# Altium schematic sheet mcu.SchDoc
size A3
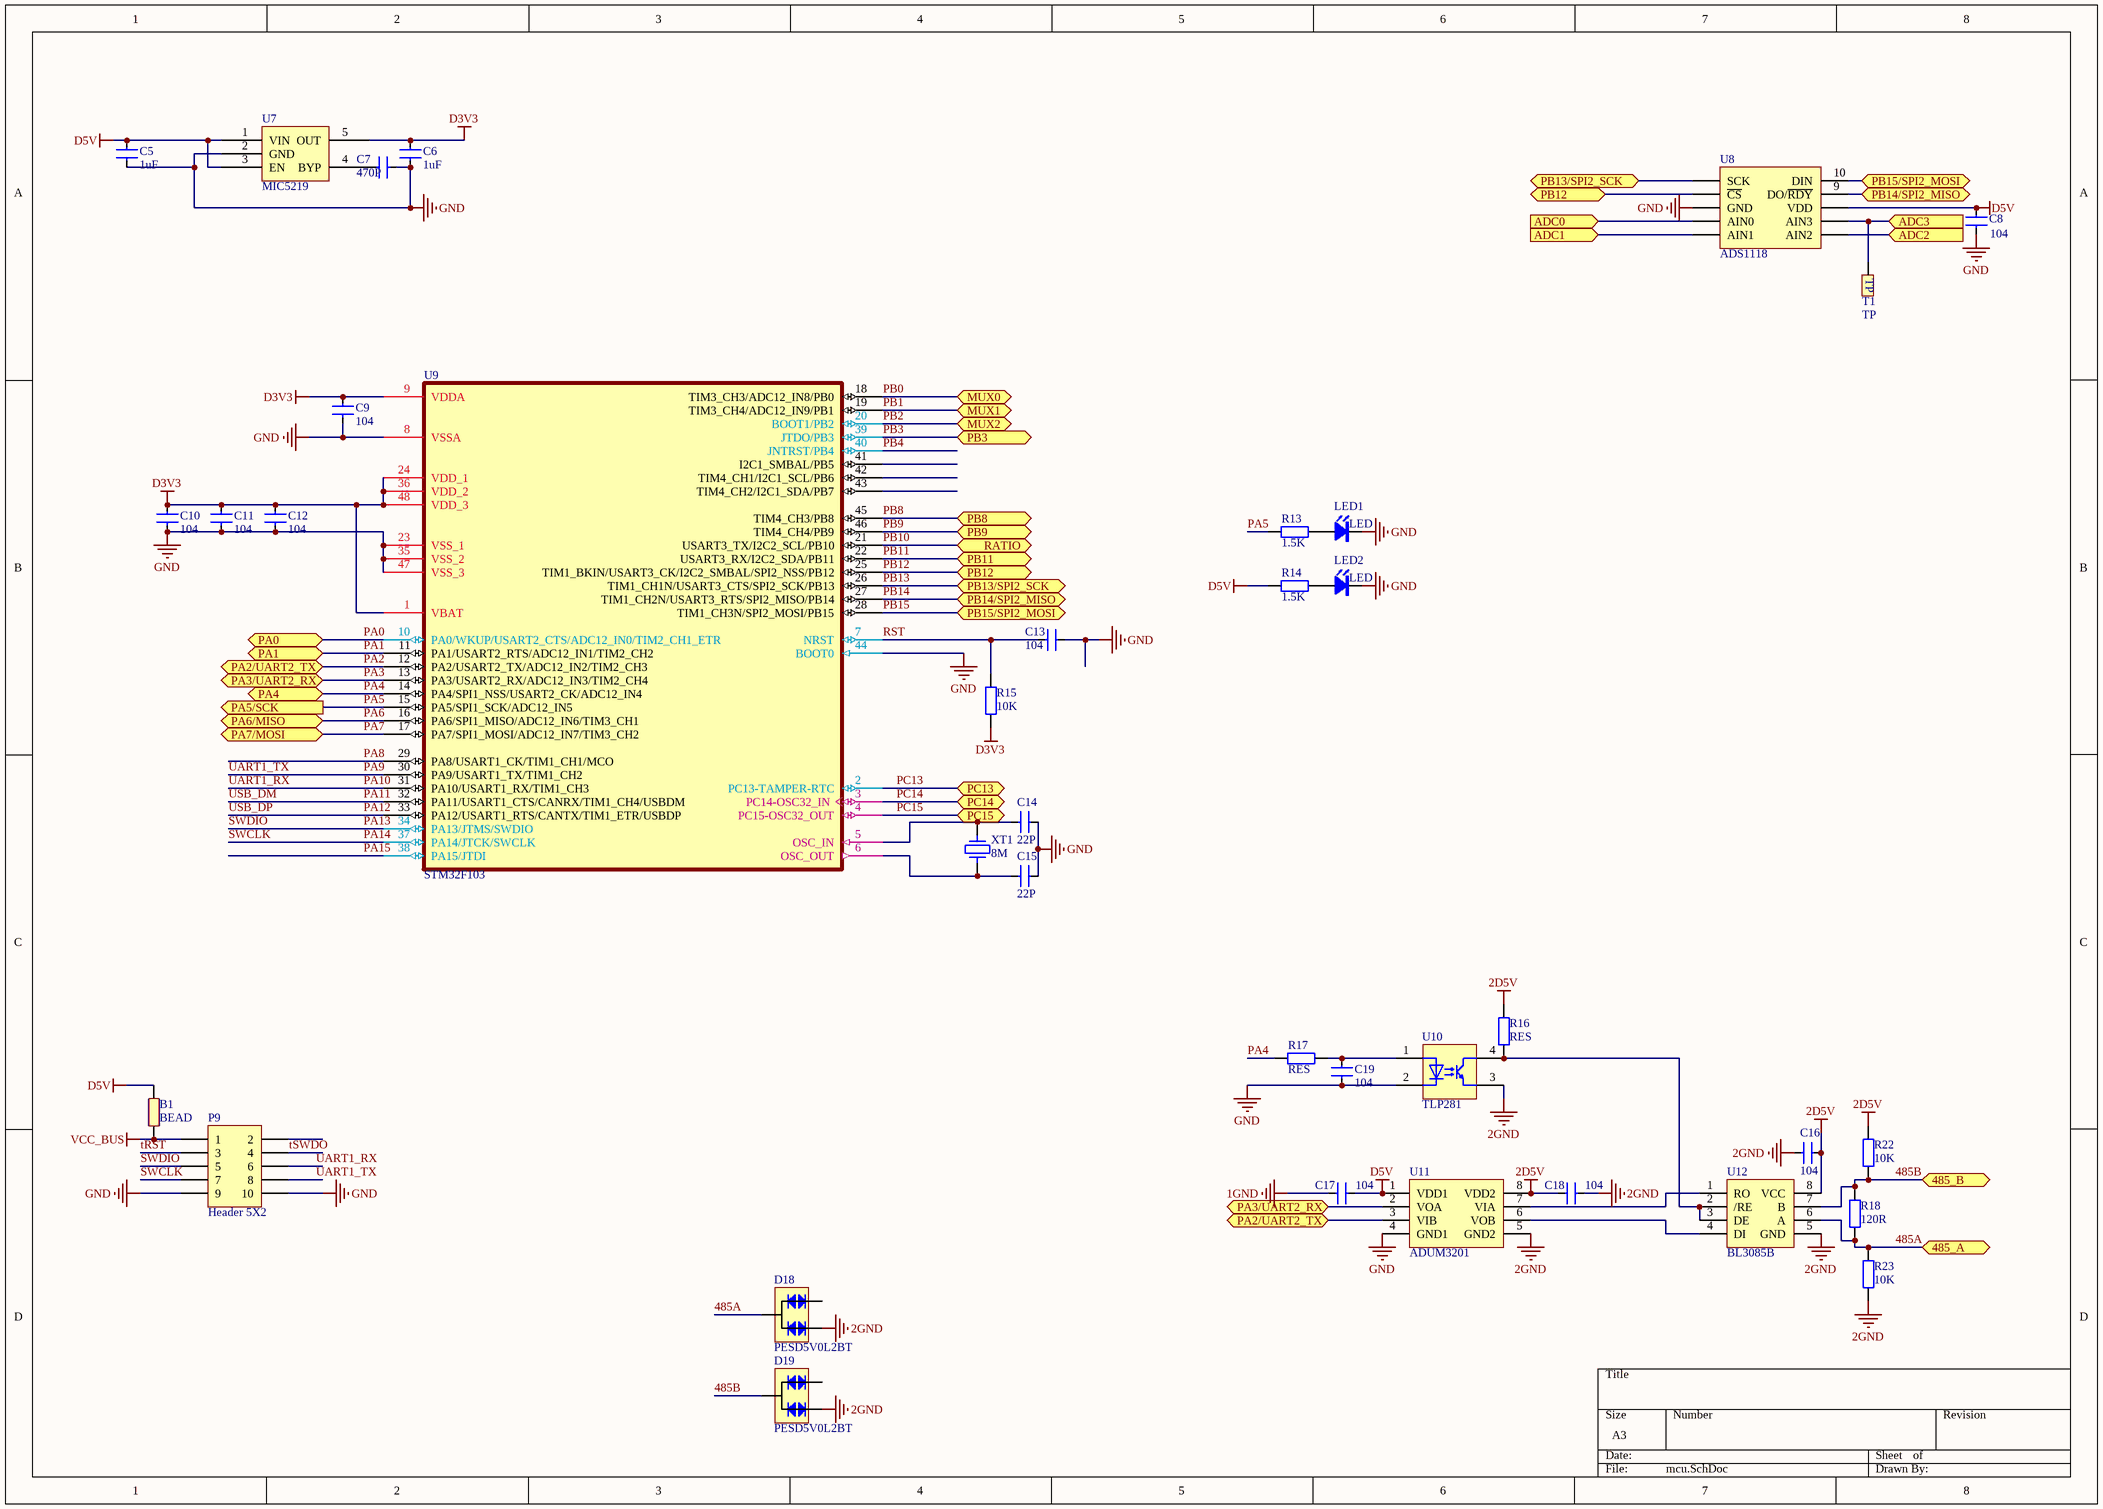
[diagram p0: mcu.SchDoc]

## Parts
B1  BEAD  [0603L]
C5  1uF  [0805C]
C6  1uF  [0805C]
C7  470P  [0603C]
C8  104  [0603C]
C9  104  [0603C]
C10  104  [0603C]
C11  104  [0603C]
C12  104  [0603C]
C13  104  [0603C]
C14  22P  [0603C]
C15  22P  [0603C]
C16  104  [0603C]
C17  104  [0603C]
C18  104  [0603C]
C19  104  [0603C]
D18  PESD5V0L2BT  [SOT23A]
D19  PESD5V0L2BT  [SOT23A]
LED1  LED  [LED-3]
LED2  LED  [LED-3]
P9  Header 5X2  [DC2.54-10]
R13  1.5K  [0603R]
R14  1.5K  [0603R]
R15  10K  [0603R]
R16  RES  [0603R]
R17  RES  [0603R]
R18  120R  [0603R]
R22  10K  [0603R]
R23  10K  [0603R]
T1  TP  [TESTP]
U7  MIC5219  [SOT23-5]
U8  ADS1118  [TSSOP10]
U9  STM32F103  [LQFP48]
U10  TLP281  [SOP4]
U11  ADUM3201  [SOP8]
U12  BL3085B  [SOP8]
XT1  8M  [5032]

## Ports
485_A, 485_B, ADC0 (in), ADC1 (in), ADC2 (in), ADC3 (in), MUX0, MUX1, MUX2, PA0, PA1, PA2/UART2_TX, PA3/UART2_RX, PA4, PA5/SCK (out), PA6/MISO, PA7/MOSI, PB3, PB8, PB9, PB11, PB12, PB13/SPI2_SCK, PB14/SPI2_MISO, PB15/SPI2_MOSI, PC13, PC14, PC15, RATIO

## Nets
1GND: C17.2
2D5V: C16.2 C18.2 R16.2 R22.2 U11.8(VDD2) U12.8(VCC)
2GND: C16.1 C18.1 D18.1 D19.1 R23.1 U10.3 U11.5(GND2) U12.5(GND)
D3V3: C6.2 C9.2 C10.2 C11.1 C12.2 R15.1 U7.5(OUT) U9.1(VBAT) U9.9(VDDA) U9.24(VDD_1) U9.36(VDD_2) U9.48(VDD_3)
D5V: B1.2 C5.2 C8.2 C17.1 R14.1 U7.1(VIN) U7.3(EN) U8.8(VDD) U11.1(VDD1)
GND: C5.1 C6.1 C7.2 C8.1 C9.1 C10.1 C11.2 C12.1 C13.2 C14.2 C15.2 C19.2 LED1.K LED2.K P9.9 P9.10 U7.2(GND) U8.3(GND) U9.8(VSSA) U9.23(VSS_1) U9.35(VSS_2) U9.44(BOOT0) U9.47(VSS_3) U10.2 U11.4(GND1)
VCC_BUS: B1.1 P9.1
485A: D18.3 R18.1 R23.2 U12.6(A) ; port 485_A
485B: D19.3 R18.2 R22.1 U12.7(B) ; port 485_B
ADC0: U8.4(AIN0) ; port ADC0
ADC1: U8.5(AIN1) ; port ADC1
ADC2: U8.6(AIN2) ; port ADC2
ADC3: T1.1 U8.7(AIN3) ; port ADC3
PA0: U9.10(PA0/WKUP/USART2_CTS/ADC12_IN0/TIM2_CH1_ETR) ; port PA0
PA1: U9.11(PA1/USART2_RTS/ADC12_IN1/TIM2_CH2) ; port PA1
PA2: U9.12(PA2/USART2_TX/ADC12_IN2/TIM2_CH3) U11.3(VIB) ; port PA2/UART2_TX
PA3: U9.13(PA3/USART2_RX/ADC12_IN3/TIM2_CH4) U11.2(VOA) ; port PA3/UART2_RX
PA4: R17.2 U9.14(PA4/SPI1_NSS/USART2_CK/ADC12_IN4) ; port PA4
PA5: R13.1 U9.15(PA5/SPI1_SCK/ADC12_IN5) ; port PA5/SCK
PA6: U9.16(PA6/SPI1_MISO/ADC12_IN6/TIM3_CH1) ; port PA6/MISO
PA7: U9.17(PA7/SPI1_MOSI/ADC12_IN7/TIM3_CH2) ; port PA7/MOSI
PA8: U9.29(PA8/USART1_CK/TIM1_CH1/MCO)
PA9: P9.8 U9.30(PA9/USART1_TX/TIM1_CH2)  [also labelled UART1_TX]
PA10: P9.6 U9.31(PA10/USART1_RX/TIM1_CH3)  [also labelled UART1_RX]
PA11: U9.32(PA11/USART1_CTS/CANRX/TIM1_CH4/USBDM)  [also labelled USB_DM]
PA12: U9.33(PA12/USART1_RTS/CANTX/TIM1_ETR/USBDP)  [also labelled USB_DP]
PA13: P9.5 U9.34(PA13/JTMS/SWDIO)  [also labelled SWDIO]
PA14: P9.7 U9.37(PA14/JTCK/SWCLK)  [also labelled SWCLK]
PA15: U9.38(PA15/JTDI)
PB0: U9.18(TIM3_CH3/ADC12_IN8/PB0) ; port MUX0
PB1: U9.19(TIM3_CH4/ADC12_IN9/PB1) ; port MUX1
PB2: U9.20(BOOT1/PB2) ; port MUX2
PB3: U9.39(JTDO/PB3) ; port PB3
PB4: U9.40(JNTRST/PB4)
PB8: U9.45(TIM4_CH3/PB8) ; port PB8
PB9: U9.46(TIM4_CH4/PB9) ; port PB9
PB10: U9.21(USART3_TX/I2C2_SCL/PB10) ; port RATIO
PB11: U9.22(USART3_RX/I2C2_SDA/PB11) ; port PB11
PB12: U8.2(~{CS}) U9.25(TIM1_BKIN/USART3_CK/I2C2_SMBAL/SPI2_NSS/PB12) ; port PB12
PB13: U8.1(SCK) U9.26(TIM1_CH1N/USART3_CTS/SPI2_SCK/PB13) ; port PB13/SPI2_SCK
PB14: U8.9(DO/~{RDY}) U9.27(TIM1_CH2N/USART3_RTS/SPI2_MISO/PB14) ; port PB14/SPI2_MISO
PB15: U8.10(DIN) U9.28(TIM1_CH3N/SPI2_MOSI/PB15) ; port PB15/SPI2_MOSI
PC13: U9.2(PC13-TAMPER-RTC) ; port PC13
PC14: U9.3(PC14-OSC32_IN) ; port PC14
PC15: U9.4(PC15-OSC32_OUT) ; port PC15
RST: C13.1 R15.2 U9.7(NRST)
tRST: P9.3
tSWDO: P9.4
NetC7_1: C7.1 U7.4(BYP)
NetC14_1: C14.1 U9.5(OSC_IN) XT1.1
NetC15_1: C15.1 U9.6(OSC_OUT) XT1.2
NetC19_1: C19.1 R17.1 U10.1
NetLED1_A: LED1.A R13.2
NetLED2_A: LED2.A R14.2
NetR16_1: R16.1 U10.4 U12.2(/RE) U12.3(DE)
NetU11_6: U11.6(VOB) U12.4(DI)
NetU11_7: U11.7(VIA) U12.1(RO)

Not connected (* = marked no-connect by the designer): D18 2; D19 2; P9 2; U9 41(I2C1_SMBAL/PB5) 42(TIM4_CH1/I2C1_SCL/PB6) 43(TIM4_CH2/I2C1_SDA/PB7)

## Notes on the sheet
- Labels drawn without touching a wire or pin: ENC1, ENC2, ENC3

## Library data of the parts
B1 = BEAD: 磁珠
C5 C6 C8 = CAP: 普通小电容; 电压: 50V
C7 C9-C19 = CAP: 普通小电容
D18 D19 = PESD5V0L2BT: schottky diod
P9 = Header 5X2: Header, 5-Pin, Dual row; LatestRevisionDate: 17-Jul-2002; LatestRevisionNote: Re-released for DXP Platform.; Publisher: Altium Limited
R13-R18 R22 R23 = RES: 普通电阻
T1 = TP: testpoint
U8 = ADS1118: 16λ ADC
U10 = TLP281: TLP281 光耦
U12 = BL3085B: BL3085B 15KV防静电485
XT1 = XT: 晶振